# Altium schematic sheet NAND8_GENERIC.SchDoc
size A4
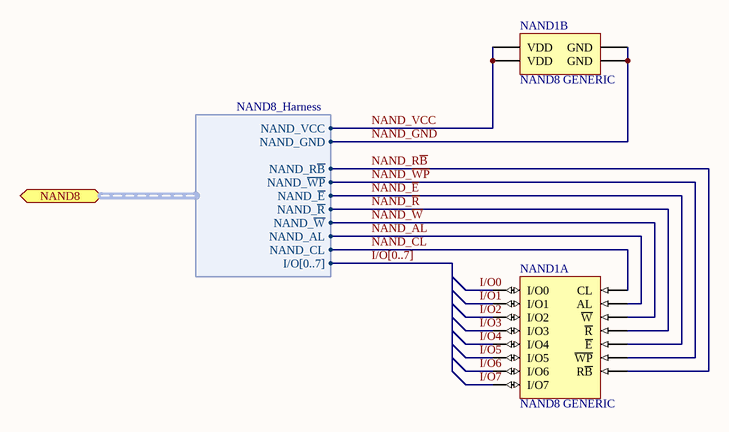
[diagram p0: NAND8_GENERIC.SchDoc]

## Parts
NAND1  NAND8 GENERIC  [TSOP48]  (parts A,B of 2)

## Ports
NAND8 (harness NAND8_Harness)

## Harnesses
NAND8_Harness: I/O[0..7], NAND_CL, NAND_AL, NAND_~{W}, NAND_~{R}, NAND_~{E}, NAND_~{WP}, NAND_R~{B}, NAND_GND, NAND_VCC

## Nets
I/O0: NAND1.29(I/O0)
I/O1: NAND1.30(I/O1)
I/O2: NAND1.31(I/O2)
I/O3: NAND1.32(I/O3)
I/O4: NAND1.41(I/O4)
I/O5: NAND1.42(I/O5)
I/O6: NAND1.43(I/O6)
I/O7: NAND1.44(I/O7)
NAND_AL: NAND1.17(AL) ; port NAND8.NAND_AL
NAND_CL: NAND1.16(CL) ; port NAND8.NAND_CL
NAND_~{E}: NAND1.9(~{E}) ; port NAND8.NAND_~{E}
NAND_GND: NAND1.13(GND) NAND1.36(GND) ; port NAND8.NAND_GND
NAND_~{R}: NAND1.8(~{R}) ; port NAND8.NAND_~{R}
NAND_R~{B}: NAND1.7(R~{B}) ; port NAND8.NAND_R~{B}
NAND_VCC: NAND1.12(VDD) NAND1.37(VDD) ; port NAND8.NAND_VCC
NAND_~{W}: NAND1.18(~{W}) ; port NAND8.NAND_~{W}
NAND_~{WP}: NAND1.19(~{WP}) ; port NAND8.NAND_~{WP}

## Buses and harness runs
bus I/O[0..7]